# Altium schematic sheet COMS0004_4_ModemRXMux.SchDoc: BLUEsat Switching Circuit
size A3; Engineer: D. JEDRYCHOWSKI; Organization: BLUEsat Project; Address1: Room 419; Address2: School of EE&T; Address3: UNSW, NSW 2052; Address4: Australia; DocumentNumber: COMS0004; SheetNumber: 4; SheetTotal: 4; Description: Selects the GMSK and AFSK modems to be used for reception; Version: 1.0
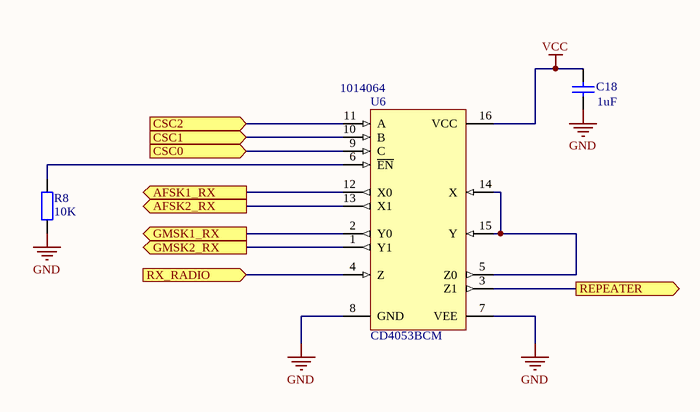
[diagram p0: COMS0004_4_ModemRXMux.SchDoc]

## Parts
C18  value 1uF  [0805]  (hidden comment: C1210)
R8  value 10K  [RESC2012N]  (hidden comment: Res1)
U6  CD4053BCM  Supplier Part Number 1: 1014064  [M16A_M]

## Ports
AFSK1_RX (out), AFSK2_RX (out), CSC0 (in), CSC1 (in), CSC2 (in), GMSK1_RX (out), GMSK2_RX (out), REPEATER (out), RX_RADIO (in)

## Nets
GND: C18.1 R8.1 U6.7(VEE) U6.8(GND)
VCC: C18.2 U6.16(VCC)
AFSK1_RX: U6.12(X0) ; port AFSK1_RX
AFSK2_RX: U6.13(X1) ; port AFSK2_RX
CSC0: U6.9(C) ; port CSC0
CSC1: U6.10(B) ; port CSC1
CSC2: U6.11(A) ; port CSC2
GMSK1_RX: U6.2(Y0) ; port GMSK1_RX
GMSK2_RX: U6.1(Y1) ; port GMSK2_RX
REPEATER: U6.3(Z1) ; port REPEATER
RX_RADIO: U6.4(Z) ; port RX_RADIO
NetR8_2: R8.2 U6.6(~{EN})
NetU6_5: U6.5(Z0) U6.14(X) U6.15(Y)

## Notes on the sheet
- Title
- Description:
- Size:
- Author:
- Date:
- A3
- Time:
- Version
- Sheet:
- Drawing No.:
- of
- File:

## Library data of the parts
C18 = Cap: Capacitor; Published: 8-Jun-2000; LatestRevisionDate: 17-Jul-2002; LatestRevisionNote: Re-released for DXP Platform.; PackageReference: RAD-0.3; Publisher: Altium Limited; PackageDescription: Radial Cap, Thru-Hole; 2 Leads; 0.3 in Pin Spacing; Supplier 1: Farnell; Supplier Part Number 1: 1637035
R8 = Res2: Resistor; Published: 8-Jun-2000; LatestRevisionDate: 17-Jul-2002; LatestRevisionNote: Re-released for DXP Platform.; PackageReference: AXIAL-0.4; Publisher: Altium Limited; PackageDescription: Axial Device, Thru-Hole; 2 Leads; 0.4 in Pin Spacing; Supplier 1: Farnell; Supplier Part Number 1: 1811779
U6 = CD4053BCM: Triple 2-Channnel Analog Multiplexer/Demutiplexer; Published: 17-Jul-2002; LatestRevisionDate: 13-Apr-2006; LatestRevisionNote: IPC-7351 Footprint Added.; DatasheetVersion: Jan-1999; PackageVersion: 2000; PackageReference: M16A; Publisher: Altium Limited; PackageDescription: 16-Pin Small Outline Integrated Circuit 1.27 mm Pitch; ComponentLink1Description: Manufacturer Link; ComponentLink1URL: http://www.fairchildsemi.com/; ComponentLink2Description: Datasheet; ComponentLink2URL: http://www.fairchildsemi.com/ds/CD%2FCD4052BC.pdf; Code_IPC: SOIC127P600-16; Supplier 1: Farnell